# EasyEDA Pro project PollutagNode2_rev4_2026-10-08.epro

# Schematic pollutagNode2
Board Name: PCB; Create Date: 2025-01-23; Page Name: Schematic; Project Name: PollutagNode2; Schematic Name: pollutagNode2; Update Date: 2026-04-22; Add into BOM: yes; Company: pollutants.eu; Convert to PCB: yes; Date: 2024-11-21; Draw By: Aleksei Tertychnyi; REV: 4.0; Sheet: 1/1
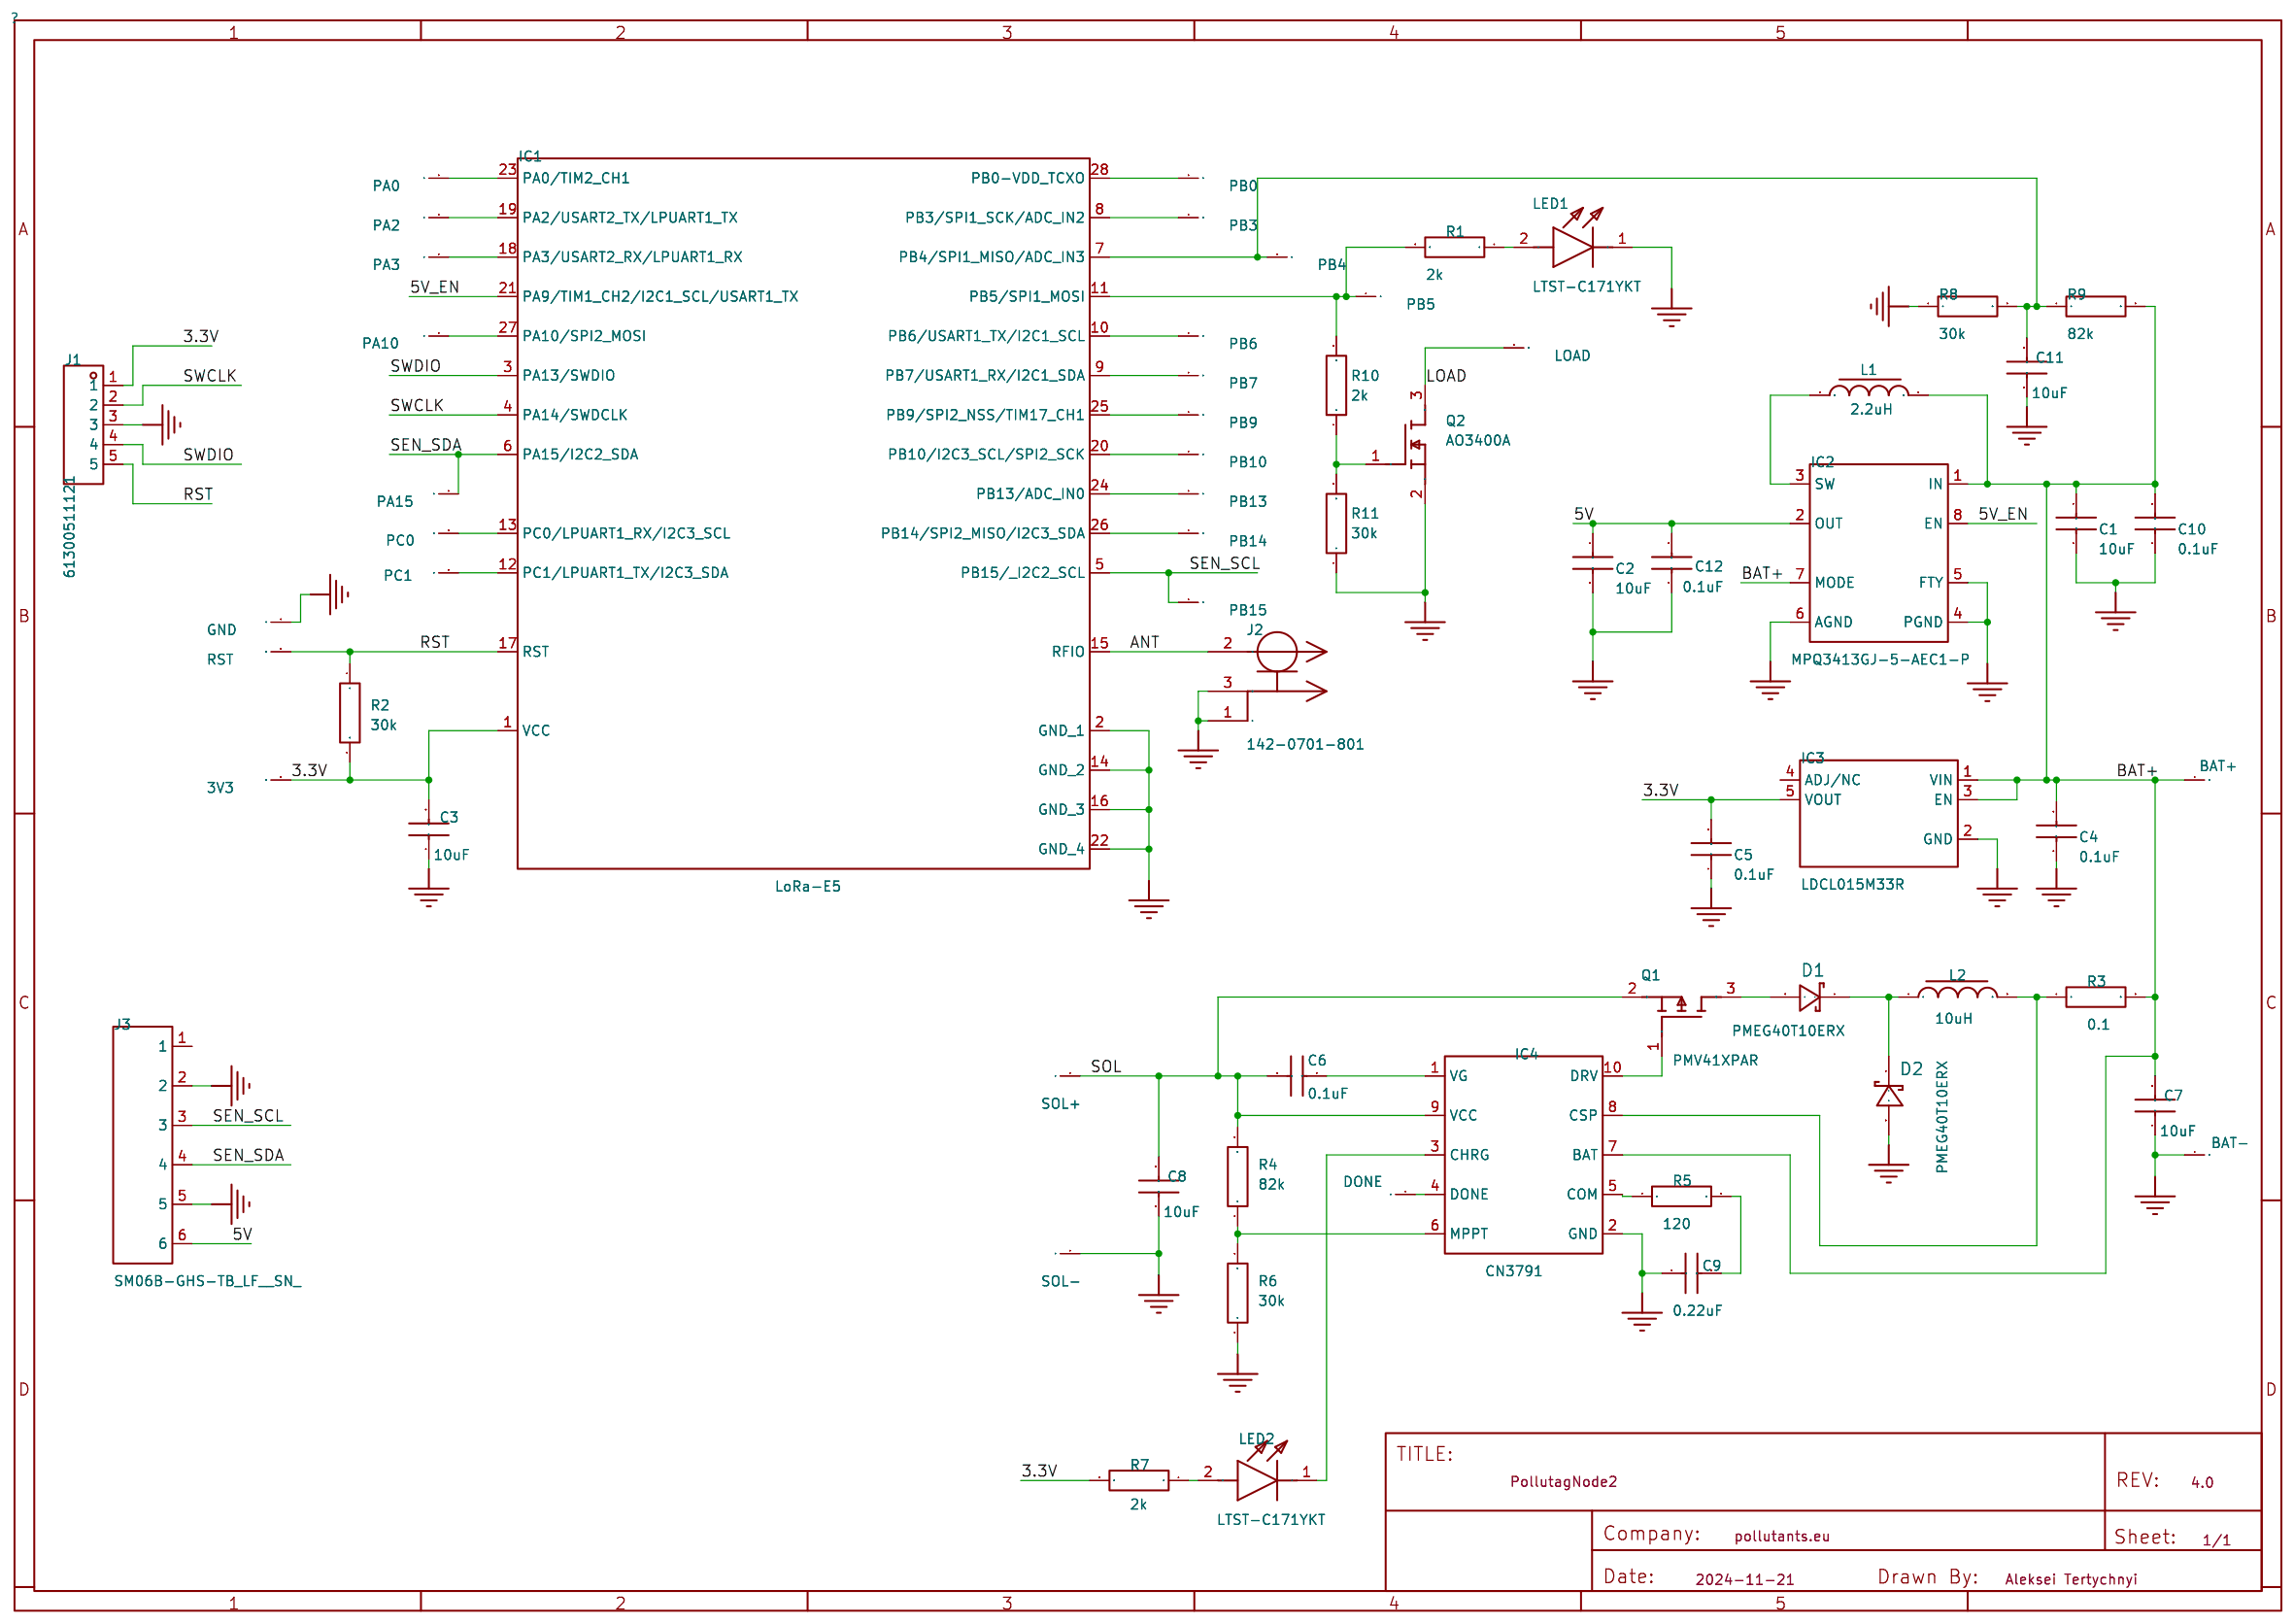
[diagram p0: schematic sheet]

## Parts
3V3  S1751-46R  [S1751-46R]  (no BOM)
BAT+  S1751-46R  [S1751-46R]  (no BOM)
BAT-  S1751-46R  [S1751-46R]  (no BOM)
C1  10uF  [CAP0603]
C2  10uF  [CAP0603]
C3  10uF  [CAP0603]
C4  0.1uF  [CAP0603]
C5  0.1uF  [CAP0603]
C6  0.1uF  [CAP0603]
C7  10uF  [CAP0603]
C8  10uF  [CAP0603]
C9  0.22uF  [CAP0603]
C10  0.1uF  [CAP0603]
C11  10uF  [CAP0603]
C12  0.1uF  [CAP0603]
D1  PMEG40T10ERX  [SOD-123_L2.6-W1.7-LS3.5-RD]
D2  PMEG40T10ERX  [SOD-123_L2.6-W1.7-LS3.5-RD]
DONE  S1751-46R  [S1751-46R]  (no BOM)
GND  S1751-46R  [S1751-46R]  (no BOM)
IC1  LoRa-E5  [LORAE5]
IC2  MPQ3413GJ-5-AEC1-P  [SOT65P280X100-8N]
IC3  LDCL015M33R  [SOT95P280X145-5N]
IC4  CN3791  [SOP100P600X175-10N]
J1  61300511121  [HDR-TH_5P-P2.54-V-M]  (no BOM)
J2  142-0701-801  [142-0701-801]
J3  SM06B-GHS-TB_LF__SN_  [SM06B-GHS-TB]
L1  2.2uH  [IND-SMD_L3.0-W3.0_SRN3015]
L2  10uH  [IND-SMD_L3.0-W3.0_SRN3015]
LED1  LTST-C171YKT  [LEDC2012X90N]
LED2  LTST-C171YKT  [LEDC2012X90N]
LOAD  S1751-46R  [S1751-46R]  (no BOM)
PA0  S1751-46R  [S1751-46R]  (no BOM)
PA2  S1751-46R  [S1751-46R]  (no BOM)
PA3  S1751-46R  [S1751-46R]  (no BOM)
PA10  S1751-46R  [S1751-46R]  (no BOM)
PA15  S1751-46R  [S1751-46R]  (no BOM)
PB0  S1751-46R  [S1751-46R]  (no BOM)
PB3  S1751-46R  [S1751-46R]  (no BOM)
PB4  S1751-46R  [S1751-46R]  (no BOM)
PB5  S1751-46R  [S1751-46R]  (no BOM)
PB6  S1751-46R  [S1751-46R]  (no BOM)
PB7  S1751-46R  [S1751-46R]  (no BOM)
PB9  S1751-46R  [S1751-46R]  (no BOM)
PB10  S1751-46R  [S1751-46R]  (no BOM)
PB13  S1751-46R  [S1751-46R]  (no BOM)
PB14  S1751-46R  [S1751-46R]  (no BOM)
PB15  S1751-46R  [S1751-46R]  (no BOM)
PC0  S1751-46R  [S1751-46R]  (no BOM)
PC1  S1751-46R  [S1751-46R]  (no BOM)
Q1  PMV41XPAR  [SOT-23-3_L2.9-W1.6-P1.90-LS2.8-BR]
Q2  AO3400A  [SOT-23-3_L2.9-W1.6-P1.90-LS2.8-BR]
R1  2k  [R0603]
R2  30k  [R0603]
R3  0.1  [RESC3216X70N]
R4  82k  [R0603]
R5  120  [R0603]
R6  30k  [R0603]
R7  2k  [R0603]
R8  30k  [R0603]
R9  82k  [R0603]
R10  2k  [R0603]
R11  30k  [R0603]
RST  S1751-46R  [S1751-46R]  (no BOM)
SOL+  S1751-46R  [S1751-46R]  (no BOM)
SOL-  S1751-46R  [S1751-46R]  (no BOM)

## Library data of the parts
3V3 BAT+ BAT- DONE GND LOAD PA0 PA2 PA3 PA10 PA15 PB0 PB3-PB7 PB9 PB10 PB13-PB15 PC0 PC1 RST SOL+ SOL- = S1751-46R: Supplier: Mouser; Supplier Part: 855-S1751-46R; Manufacturer: Harwin
C1-C3 C7 C8 C11 = 10uF: Supplier Part: 81-GRM188R61C106KALD; Manufacturer: Murata Electronics; Manufacturer Part: GRM188R61C106KALD; Supplier: Mouser
C4-C6 C10 C12 = 0.1uF: Supplier: Mouser; Supplier Part: 581-06035C104KAT2A; Manufacturer: AVX; Manufacturer Part: 06035C104KAT2A
C9 = 0.22uF: Supplier Part: 603-AC0603X7R9BB224; Manufacturer: KEMET; Supplier: Mouser; Manufacturer Part: AC0603X7R9BB224
D1 D2 = PMEG40T10ERX: Diode Configuration:1 Independent Voltage - Forward(Vf@If):460mV@1A Voltage - DC Reverse(Vr):40V Current - Rectified:1A Reverse Leakage Current (Ir):22uA@40V Non-Repetitive Peak Forward Surge Current:20A; LCSC Part Name: 电压:40V 电流:1A; Supplier Part: C552916; Manufacturer: Nexperia(安世); Supplier Footprint: SOD-123W; JLCPCB Part Class: Extended Part; Datasheet: https://item.szlcsc.com/datasheet/PMEG40T10ERX/573913.html; Supplier: LCSC; Diode Configuration: 1 Independent; Voltage - Forward(Vf@If): 460mV@1A; Voltage - DC Reverse(Vr): 40V; Current - Rectified: 1A; Reverse Leakage Current (Ir): 22uA@40V; Non-Repetitive Peak Forward Surge Current: 20A
IC1 = LoRa-E5: Supplier Part: 713-317990687; Manufacturer: SEEED STUDIO; Manufacturer Part: 317990687; Supplier: Mouser
IC2 = MPQ3413GJ-5-AEC1-P: Supplier Part: 946-MPQ3413GJ5AEC1P; Supplier: Mouser; Manufacturer: Monolithic Power Systems (MPS)
IC3 = LDCL015M33R: Supplier Part: 511-LDCL015M33R; Manufacturer: STMicroelectronics; Supplier: Mouser
IC4 = CN3791: Supplier Part: C154992; Manufacturer: Consonance; Supplier: LCSC
J1 = 61300511121: Pitch:2.54mm Mounting Type:Direct Insert Number of Rows:Single Row Number of Pins:5P Current Rating (Max):3A Voltage Rating (Max):250V Contact Material:Copper Alloy Operating Temperature Range:-40℃~+105℃ Operating Temperature Range:-40℃~+105℃ Color:Black; Manufacturer: Wurth(伍尔特); Supplier: LCSC; Supplier Part: C6461551; LCSC Part Name: 间距:2.54mm 直插; Supplier Footprint: 插件,P=2.54mm; JLCPCB Part Class: Extended Part; Pitch: 2.54mm; Mounting Type: Direct Insert; Number of Rows: Single Row; Number of Pins: 5P; Current Rating (Max): 3A; Voltage Rating (Max): 250V; Contact Material: Copper Alloy; Operating Temperature Range: -40℃~+105℃; Color: Black
J2 = 142-0701-801: Supplier Part: 530-142-0701-801; Manufacturer: Cinch Connectivity Solutions; Supplier: Mouser
J3 = SM06B-GHS-TB_LF__SN_: Supplier Part: 306-SM06BGHSTBLFSN; Manufacturer: JST (JAPAN SOLDERLESS TERMINALS); Manufacturer Part: SM06B-GHS-TB(LF)(SN); Supplier: Mouser
L1 = 2.2uH: Manufacturer: Bourns; Supplier Part: 652-SRN3015-2R2M; Supplier: Mouser; Manufacturer Part: SRN3015-2R2M
L2 = 10uH: Supplier Part: 652-SRN3015BTA-100M; Manufacturer: Bourns; Supplier: Mouser; Manufacturer Part: SRN3015BTA-100M
LED1 LED2 = LTST-C171YKT: Supplier Part: 859-LTST-C171YKT; Manufacturer: Lite-On; Supplier: Mouser
Q1 = PMV41XPAR: Manufacturer: Nexperia; Supplier Part: 771-PMV41XPAR; Supplier: Mouser
Q2 = AO3400A: Supplier Part: 785-1000-1-ND; Manufacturer: Alpha & Omega Semiconductors; Supplier: Digi-Key
R1 R7 R10 = 2k: Supplier Part: 603-RC0603FR-072KL; Manufacturer: Yageo; Supplier: Mouser; Manufacturer Part: RC0603FR-072KL
R2 R6 R8 R11 = 30k: Supplier Part: 652-CR0603FX-3002ELF; Manufacturer: Bourns; Supplier: Mouser; Manufacturer Part: CR0603-FX-3002ELF
R3 = 0.1: Supplier Part: 652-CRL1206FWR100ELF; Manufacturer: Bourns; Supplier: Mouser; Manufacturer Part: CRL1206FWR100ELF
R4 R9 = 82k: Supplier Part: 603-RT0603FRE0782KL; Manufacturer: KEMET; Supplier: Mouser; Manufacturer Part: RT0603FRE0782KL
R5 = 120: Supplier Part: 667-ERJ-U03J121V; Manufacturer: Panasonic; Supplier: Mouser; Manufacturer Part: ERJ-U03J121V

## Nets
3.3V: 3V3.1 C3.2 C5.2 IC1.1(VCC) IC3.5(VOUT) J1.1 R2.2 R7.2
5V: C2.1 C12.2 IC2.2(OUT) J3.6
5V_EN: IC1.21(PA9/TIM1_CH2/I2C1_SCL/USART1_TX) IC2.8(EN)
GND: BAT-.1 C1.2 C2.2 C3.1 C4.1 C5.1 C7.1 C8.1 C9.1 C10.1 C11.1 C12.1 D2.2(+) GND.1 IC1.2(GND_1) IC1.14(GND_2) IC1.16(GND_3) IC1.22(GND_4) IC2.4(PGND) IC2.5(FTY) IC2.6(AGND) IC3.2(GND) IC4.2(GND) J1.3 J2.1 J2.3 J3.2 J3.5 LED1.1(K) Q2.2(S) R6.1 R8.1 R11.1 SOL-.1
ANT: IC1.15(RFIO) J2.2
BAT+: BAT+.1 C1.1 C4.2 C7.2 C10.2 IC2.1(IN) IC2.7(MODE) IC3.1(VIN) IC3.3(EN) IC4.7(BAT) L1.1 R3.2 R9.2
LOAD: LOAD.1 Q2.3(D)
RST: IC1.17(RST) J1.5 R2.1 RST.1
SEN_SCL: IC1.5(PB15/ I2C2_SCL) J3.3 PB15.1
SEN_SDA: IC1.6(PA15/I2C2_SDA) J3.4 PA15.1
SOL: C6.1 C8.2 IC4.9(VCC) Q1.2(S) R4.2 SOL+.1
SWCLK: IC1.4(PA14/SWDCLK) J1.2
SWDIO: IC1.3(PA13/SWDIO) J1.4
$1N6: IC1.11(PB5/SPI1_MOSI) PB5.1 R1.2 R10.2
$1N7: Q2.1(G) R10.1 R11.2
$1N11: IC4.3(CHRG) LED2.1(K)
$1N12: C11.2 IC1.7(PB4/SPI1_MISO/ADC_IN3) PB4.1 R8.2 R9.1
$1N25: IC1.12(PC1/LPUART1_TX/I2C3_SDA) PC1.1
$1N26: IC1.13(PC0/LPUART1_RX/I2C3_SCL) PC0.1
$1N28: IC1.27(PA10/SPI2_MOSI) PA10.1
$1N29: IC1.18(PA3/USART2_RX/LPUART1_RX) PA3.1
$1N30: IC1.19(PA2/USART2_TX/LPUART1_TX) PA2.1
$1N31: IC1.23(PA0/TIM2_CH1) PA0.1
$1N32: IC1.26(PB14/SPI2_MISO/I2C3_SDA) PB14.1
$1N33: IC1.24(PB13/ADC_IN0) PB13.1
$1N34: IC1.20(PB10/I2C3_SCL/SPI2_SCK) PB10.1
$1N35: IC1.25(PB9/SPI2_NSS/TIM17_CH1) PB9.1
$1N36: IC1.9(PB7/USART1_RX/I2C1_SDA) PB7.1
$1N37: IC1.10(PB6/USART1_TX/I2C1_SCL) PB6.1
$1N40: IC1.8(PB3/SPI1_SCK/ADC_IN2) PB3.1
$1N50: LED1.2(A) R1.1
$1N57: IC2.3(SW) L1.2
$1N60: C9.2 R5.2
$1N61: IC4.5(COM) R5.1
$1N63: IC4.8(CSP) L2.2 R3.1
$1N64: D1.1(-) D2.1(-) L2.1
$1N72: D1.2(+) Q1.3(D)
$1N73: IC4.10(DRV) Q1.1(G)
$1N75: LED2.2(A) R7.1
$1N76: IC4.6(MPPT) R4.1 R6.2
$1N77: IC1.28(PB0-VDD_TCXO) PB0.1
$1N78: C6.2 IC4.1(VG)
$1N83: DONE.1 IC4.4(DONE)

Not connected (* = marked no-connect by the designer): IC3 4(ADJ/NC); J3 1

# Board PCB
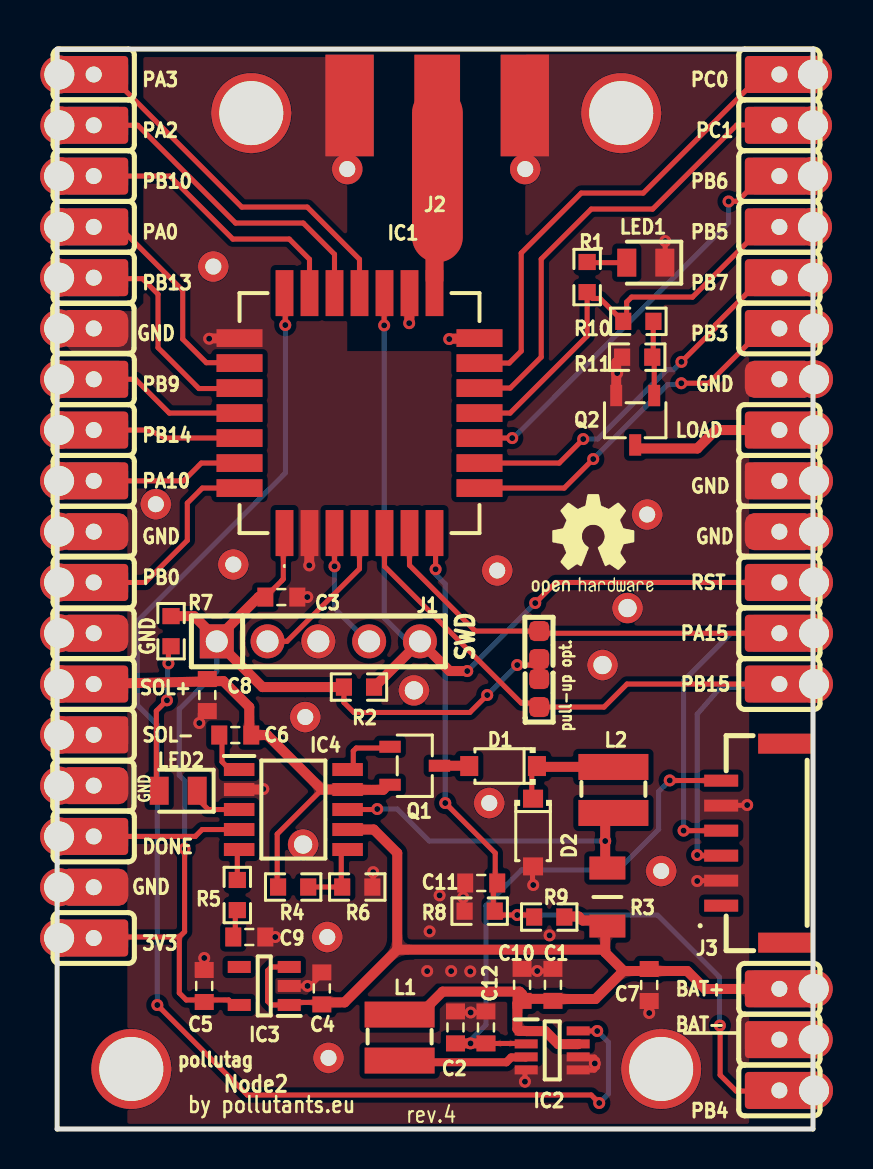
[diagram p1: board, top side]
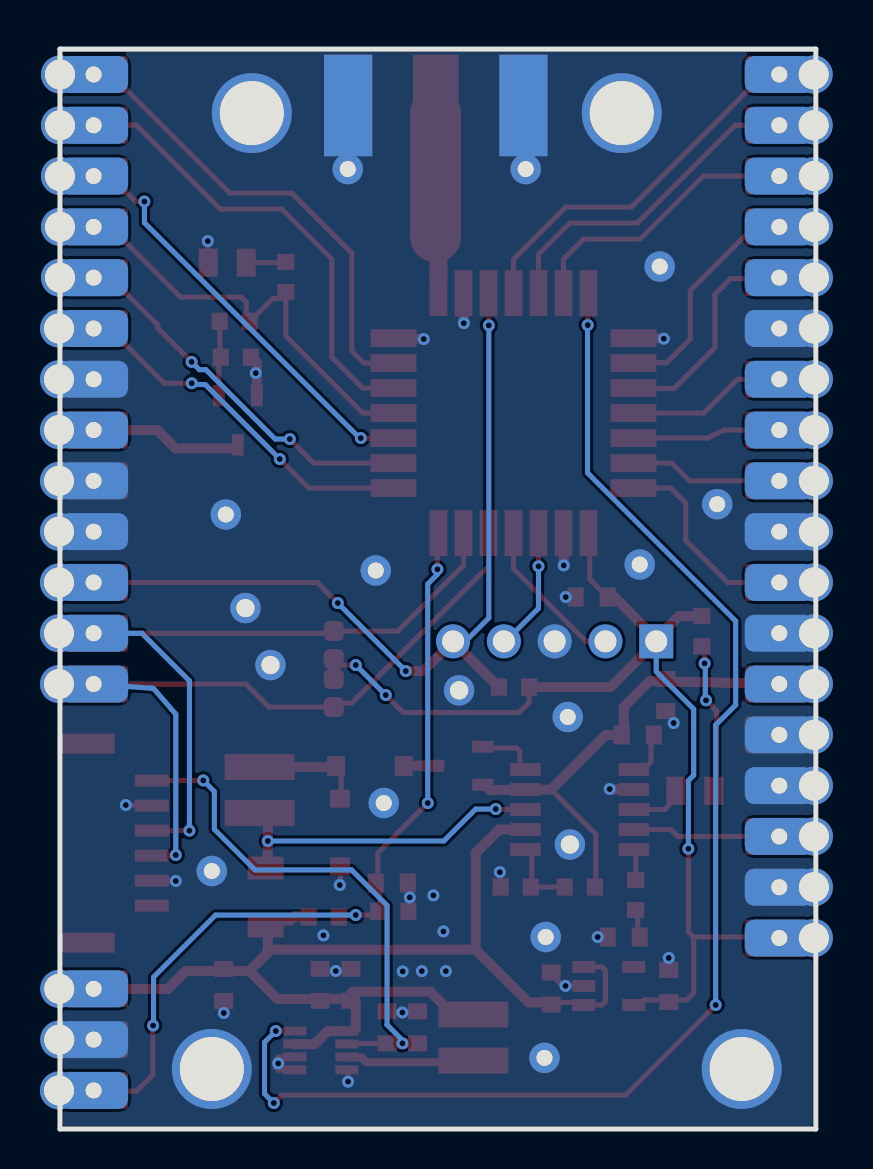
[diagram p2: board, bottom side, seen from below]

Outline 37.8 x 54 mm; copper layers: Top Layer, Bottom Layer. Coordinates in mm from the lower left corner of the outline.
Outline path: 0,54 0,0 37.8,0 37.8,54 0,54
Stack: Top Layer 0.035mm / Dielectric1 1.51mm FR4 er 4.5 / Bottom Layer 0.035mm

## Design rules (mm)
spacing Default (default): track to track 0.025, other pairs 0 to 0.025
spacing Plane_Default: track to track 0.025, other pairs 0 to 0.025
spacing Copper_Default: track to track 0.025, other pairs 0 to 0.025
spacing Copper_CopperRegion: track to track 0.025, other pairs 0 to 0.025
spacing Copper_(1): track to track 0.025, other pairs 0 to 0.025
spacing Copper_(2): track to track 0.025, other pairs 0 to 0.025
track width Default (default): min 0.025, default 0.025, max 25.4
differential pair differentialPair (default): width min 0.127, default 0.254, max 2.54; gap min 0.152, default 0.152
pour e784 uses CopperRegion, Copper_Default
pour e978 uses (2), Copper_Default
pour e895 uses CopperRegion, Copper_Default

## Placement (name value [footprint] x y rotation side)
3V3  -  [S1751-46R]  1.83 9.55 180 top
BAT+  -  [S1751-46R]  36.12 7.01 180 top
BAT-  -  [S1751-46R]  36.12 4.47 180 top
C1  10uF  [CAP0603]  24.79 7.21 90 top
C2  10uF  [CAP0603]  19.92 5.08 90 top
C3  10uF  [CAP0603]  11.21 26.6 180 top
C4  0.1uF  [CAP0603]  13.23 7.03 270 top
C5  0.1uF  [CAP0603]  7.35 7.15 270 top
C6  0.1uF  [CAP0603]  8.91 19.7 180 top
C7  10uF  [CAP0603]  29.61 7.2 90 top
C8  10uF  [CAP0603]  7.51 21.7 90 top
C9  0.22uF  [CAP0603]  9.61 9.6 180 top
C10  0.1uF  [CAP0603]  23.25 7.21 270 top
C11  10uF  [CAP0603]  21.21 12.3 0 top
C12  0.1uF  [CAP0603]  21.44 5.08 270 top
D1  PMEG40T10ERX  [SOD-123_L2.6-W1.7-LS3.5-RD]  22.3 18.15 180 top
D2  PMEG40T10ERX  [SOD-123_L2.6-W1.7-LS3.5-RD]  23.8 14.83 270 top
DONE  -  [S1751-46R]  1.83 14.63 180 top
GND  -  [S1751-46R]  36.12 32.41 180 top
IC1  LoRa-E5  [LORAE5]  15.12 35.8 90 top
IC2  MPQ3413GJ-5-AEC1-P  [SOT65P280X100-8N]  24.76 3.93 0 top
IC3  LDCL015M33R  [SOT95P280X145-5N]  10.36 7.15 180 top
IC4  CN3791  [SOP100P600X175-10N]  11.81 15.98 0 top
J1  61300511121  [HDR-TH_5P-P2.54-V-M]  13.06 24.38 0 top
J2  -  [142-0701-801]  19.01 53.72 0 top
J3  SM06B-GHS-TB_LF__SN_  [SM06B-GHS-TB]  37.51 8.92 90 top
L1  2.2uH  [IND-SMD_L3.0-W3.0_SRN3015]  17.13 4.57 270 top
L2  10uH  [IND-SMD_L3.0-W3.0_SRN3015]  27.82 16.95 270 top
LED1  LTST-C171YKT  [LEDC2012X90N]  29.44 43.32 180 top
LED2  LTST-C171YKT  [LEDC2012X90N]  6.05 16.92 180 top
LOAD  -  [S1751-46R]  36.12 34.95 180 top
NOREF  -  [Pad_e106]  37.8 45.11 0 top
NOREF#2  -  [Pad_e103]  37.8 52.73 0 top
NOREF#3  -  [Pad_e122]  0.1 45.11 0 top
NOREF#4  -  [Pad_e74]  36.12 34.95 0 top
NOREF#5  -  [Pad_e121]  0.1 47.65 0 top
NOREF#6  -  [Pad_e166]  36.12 42.57 0 top
NOREF#7  -  [Pad_e105]  37.8 47.65 0 top
NOREF#8  -  [Pad_e142]  7.81 43.13 0 top
NOREF#9  -  [Pad_e146]  1.83 12.09 0 top
NOREF#10  -  [Pad_e101]  24.11 23.5 0 top
NOREF#11  -  [Pad_e160]  36.12 50.19 0 top
NOREF#12  -  [Pad_e117]  37.84 4.47 0 top
NOREF#13  -  [Pad_e80]  36.12 50.19 0 top
NOREF#14  -  [Pad_e86]  1.83 42.57 0 top
NOREF#15  -  [Pad_e185]  36.12 27.33 0 top
NOREF#16  -  [Pad_e78]  36.12 45.11 0 top
NOREF#17  -  [Pad_e70]  36.12 24.79 0 top
NOREF#18  -  [Pad_e144]  22.01 27.93 0 top
NOREF#19  -  [Pad_e108]  37.85 37.49 0 top
NOREF#20  -  [Pad_e110]  37.85 34.95 0 top
NOREF#21  -  [Pad_e81]  36.12 52.73 0 top
NOREF#22  -  [Pad_e87]  1.83 37.49 0 top
NOREF#23  -  [Pad_e95]  1.83 29.87 0 top
NOREF#24  -  [Pad_e133]  0.1 17.17 0 top
NOREF#25  -  [Pad_e171]  3.71 3 0 top
NOREF#26  -  [Pad_e180]  36.12 32.41 0 top
NOREF#27  -  [Pad_e68]  36.12 7.01 0 top
NOREF#28  -  [Pad_e155]  1.83 42.57 0 top
NOREF#29  -  [Pad_e177]  36.12 7.01 0 top
NOREF#30  -  [Pad_e188]  17.84 21.93 0 top
NOREF#31  -  [Pad_e189]  28.53 26.05 0 top
NOREF#32  -  [Pad_e178]  36.12 45.11 0 top
NOREF#33  -  [Pad_e127]  0.1 32.41 0 top
NOREF#34  -  [Pad_e128]  0.1 29.87 0 top
NOREF#35  -  [Pad_e140]  30.21 12.9 0 top
NOREF#36  -  [Pad_e100]  24.11 22.5 0 top
NOREF#37  -  [Pad_e153]  1.83 37.49 0 top
NOREF#38  -  [Pad_e141]  13.57 3.56 0 top
NOREF#39  -  [Pad_e159]  36.12 52.73 0 top
NOREF#40  -  [Pad_e92]  1.83 12.09 0 top
NOREF#41  -  [Pad_e136]  0.1 9.55 0 top
NOREF#42  -  [Pad_e154]  1.83 40.03 0 top
NOREF#43  -  [Pad_e102]  24.11 24.9 0 top
NOREF#44  -  [Pad_e137]  12.41 20.6 0 top
NOREF#45  -  [Pad_e173]  14.51 48 0 top
NOREF#46  -  [Pad_e174]  23.41 48 0 top
NOREF#47  -  [Pad_e69]  36.12 22.25 0 top
NOREF#48  -  [Pad_e111]  37.85 32.41 0 top
NOREF#49  -  [Pad_e93]  1.83 17.17 0 top
NOREF#50  -  [Pad_e85]  1.83 45.11 0 top
NOREF#51  -  [Pad_e64]  1.83 27.33 0 top
NOREF#52  -  [Pad_e132]  0.1 19.71 0 top
NOREF#53  -  [Pad_e107]  37.8 42.57 0 top
NOREF#54  -  [Pad_e172]  28.21 50.8 0 top
NOREF#55  -  [Pad_e165]  36.12 40.03 0 top
NOREF#56  -  [Pad_e82]  1.83 52.73 0 top
NOREF#57  -  [Pad_e67]  36.12 4.47 0 top
NOREF#58  -  [Pad_e163]  36.12 29.87 0 top
NOREF#59  -  [Pad_e120]  0.11 50.19 0 top
NOREF#60  -  [Pad_e152]  1.83 34.95 0 top
NOREF#61  -  [Pad_e162]  1.83 52.73 0 top
NOREF#62  -  [Pad_e139]  13.51 9.6 0 top
NOREF#63  -  [Pad_e150]  1.83 27.33 0 top
NOREF#64  -  [Pad_e125]  0.1 37.49 0 top
NOREF#65  -  [Pad_e138]  21.61 16.3 0 top
NOREF#66  -  [Pad_e148]  1.83 24.79 0 top
NOREF#67  -  [Pad_e90]  1.83 29.87 0 top
NOREF#68  -  [Pad_e130]  0.1 24.79 0 top
NOREF#69  -  [Pad_e156]  1.83 45.11 0 top
NOREF#70  -  [Pad_e151]  1.83 32.41 0 top
NOREF#71  -  [Pad_e66]  36.12 1.93 0 top
NOREF#72  -  [Pad_e182]  36.12 4.47 0 top
NOREF#73  -  [Pad_e119]  0.11 52.73 0 top
NOREF#74  -  [Pad_e91]  1.83 40.03 0 top
NOREF#75  -  [Pad_e175]  1.83 22.25 0 top
NOREF#76  -  [Pad_e176]  1.83 19.71 0 top
NOREF#77  -  [Pad_e129]  0.1 27.33 0 top
NOREF#78  -  [Pad_e169]  9.71 50.8 0 top
NOREF#79  -  [Pad_e124]  0.1 40.03 0 top
NOREF#80  -  [Pad_e135]  0.1 12.09 0 top
NOREF#81  -  [Pad_e114]  37.85 24.79 0 top
NOREF#82  -  [Pad_e161]  36.12 47.65 0 top
NOREF#83  -  [Pad_e167]  1.83 9.55 0 top
NOREF#84  -  [Pad_e186]  4.93 31.24 0 top
NOREF#85  -  [Pad_e76]  36.12 40.03 0 top
NOREF#86  -  [Pad_e113]  37.85 27.33 0 top
NOREF#87  -  [Pad_e116]  37.84 7.01 0 top
NOREF#88  -  [Pad_e126]  0.09 34.95 0 top
NOREF#89  -  [Pad_e118]  37.85 1.93 0 top
NOREF#90  -  [Pad_e58]  1.83 9.55 0 top
NOREF#91  -  [Pad_e143]  8.81 28.23 0 top
NOREF#92  -  [Pad_e75]  36.12 37.49 0 top
NOREF#93  -  [Pad_e99]  24.11 21.1 0 top
NOREF#94  -  [Pad_e84]  1.83 47.65 0 top
NOREF#95  -  [Pad_e134]  0.1 14.63 0 top
NOREF#96  -  [Pad_e164]  36.12 37.49 0 top
NOREF#97  -  [Pad_e83]  1.83 50.19 0 top
NOREF#98  -  [Pad_e59]  1.83 12.09 0 top
NOREF#99  -  [Pad_e145]  29.51 30.73 0 top
NOREF#100  -  [Pad_e187]  12.3 14.22 0 top
NOREF#101  -  [Pad_e123]  0.1 42.57 0 top
NOREF#102  -  [Pad_e62]  1.83 19.71 0 top
NOREF#103  -  [Pad_e88]  1.83 34.95 0 top
NOREF#104  -  [Pad_e109]  37.85 40.03 0 top
NOREF#105  -  [Pad_e98]  36.12 37.49 0 top
NOREF#106  -  [Pad_e71]  36.12 27.33 0 top
NOREF#107  -  [Pad_e112]  37.85 29.87 0 top
NOREF#108  -  [Pad_e61]  1.83 17.17 0 top
NOREF#109  -  [Pad_e79]  36.12 47.65 0 top
NOREF#110  -  [Pad_e73]  36.12 32.41 0 top
NOREF#111  -  [Pad_e77]  36.12 42.57 0 top
NOREF#112  -  [Pad_e147]  1.83 17.17 0 top
NOREF#113  -  [Pad_e131]  0.1 22.25 0 top
NOREF#114  -  [Pad_e104]  37.8 50.19 0 top
NOREF#115  -  [Pad_e183]  36.12 22.25 0 top
NOREF#116  -  [Pad_e97]  36.12 29.87 0 top
NOREF#117  -  [Pad_e181]  36.12 1.93 0 top
NOREF#118  -  [Pad_e60]  1.83 14.63 0 top
NOREF#119  -  [Pad_e89]  1.83 32.41 0 top
NOREF#120  -  [Pad_e190]  27.28 23.2 0 top
NOREF#121  -  [Pad_e96]  1.83 40.03 0 top
NOREF#122  -  [Pad_e72]  36.12 29.87 0 top
NOREF#123  -  [Pad_e63]  1.83 22.25 0 top
NOREF#124  -  [Pad_e168]  1.83 14.63 0 top
NOREF#125  -  [Pad_e158]  1.83 50.19 0 top
NOREF#126  -  [Pad_e179]  36.12 34.95 0 top
NOREF#127  -  [Pad_e94]  1.83 24.79 0 top
NOREF#128  -  [Pad_e170]  30.21 3 0 top
NOREF#129  -  [Pad_e157]  1.83 47.65 0 top
NOREF#130  -  [Pad_e65]  1.83 24.79 0 top
NOREF#131  -  [Pad_e149]  1.83 29.87 0 top
NOREF#132  -  [Pad_e115]  37.85 22.25 0 top
NOREF#133  -  [Pad_e184]  36.12 24.79 0 top
PA0  -  [S1751-46R]  1.83 45.11 0 top
PA2  -  [S1751-46R]  1.83 50.19 180 top
PA3  -  [S1751-46R]  1.83 52.73 180 top
PA10  -  [S1751-46R]  1.83 32.41 180 top
PA15  -  [S1751-46R]  36.12 24.79 180 top
PB0  -  [S1751-46R]  1.83 27.33 180 top
PB3  -  [S1751-46R]  36.12 40.03 180 top
PB4  -  [S1751-46R]  36.12 1.93 180 top
PB5  -  [S1751-46R]  36.12 45.11 180 top
PB6  -  [S1751-46R]  36.12 47.65 0 top
PB7  -  [S1751-46R]  36.12 42.57 180 top
PB9  -  [S1751-46R]  1.83 37.49 0 top
PB10  -  [S1751-46R]  1.83 47.65 0 top
PB13  -  [S1751-46R]  1.83 42.57 0 top
PB14  -  [S1751-46R]  1.83 34.95 180 top
PB15  -  [S1751-46R]  36.12 22.25 180 top
PC0  -  [S1751-46R]  36.12 52.73 0 top
PC1  -  [S1751-46R]  36.12 50.19 180 top
Q1  PMV41XPAR  [SOT-23-3_L2.9-W1.6-P1.90-LS2.8-BR]  17.88 18.16 180 top
Q2  AO3400A  [SOT-23-3_L2.9-W1.6-P1.90-LS2.8-BR]  28.91 35.44 90 top
R1  2k  [R0603]  26.5 42.6 270 top
R2  30k  [R0603]  15.09 22.1 180 top
R3  0.1  [RESC3216X70N]  27.52 11.6 270 top
R4  82k  [R0603]  11.8 12.1 180 top
R5  120  [R0603]  9.01 11.7 270 top
R6  30k  [R0603]  15.01 12.1 180 top
R7  2k  [R0603]  5.7 24.89 90 top
R8  30k  [R0603]  21.13 10.89 0 top
R9  82k  [R0603]  24.61 10.6 0 top
R10  2k  [R0603]  29.06 40.39 180 top
R11  30k  [R0603]  29.01 38.59 0 top
RST  -  [S1751-46R]  36.12 27.33 180 top
SOL+  -  [S1751-46R]  1.83 22.25 180 top
SOL-  -  [S1751-46R]  1.83 19.71 180 top

## Footprints (pads in the part's own frame, mm; a bottom-side part is the same pattern mirrored in y, then rotated)
142-0701-801
  rect 2.413x5.08 smd: 1(-4.381,-2.54) 3(4.381,-2.54)
  rect 2.413x5.08 smd far side: 1(-4.381,-2.54) 3(4.381,-2.54)
  rect 2.286x5.08 smd: 2(0,-2.54)
CAP0603
  rect 0.8x0.95 smd: 1(-0.8,0) 2(0.8,0)
HDR-TH_5P-P2.54-V-M
  rect 1.7x1.7 hole 1.1: 1(-5.08,0)
  round 1.7 hole 1.1: 2(-2.54,0) 3(0,0) 4(2.54,0) 5(5.08,0)
IND-SMD_L3.0-W3.0_SRN3015
  rect 1.3x3.5 smd: 1(-1.15,0) 2(1.15,0)
LEDC2012X90N
  rect 0.95x1.4 smd: 1(-0.95,0) 2(0.95,0)
LORAE5
  rect 2.3x0.889 smd: 1(-6,3.75) 2(-6,2.5) 3(-6,1.25) 4(-6,0) 5(-6,-1.25) 6(-6,-2.5) 7(-6,-3.75) 15(6,-3.75) 16(6,-2.5) 17(6,-1.25) 18(6,0) 19(6,1.25) 20(6,2.5) 21(6,3.75)
  rect 0.889x2.3 smd: 8(-3.75,-6) 9(-2.5,-6) 10(-1.25,-6) 11(0,-6) 12(1.25,-6) 13(2.5,-6) 14(3.75,-6) 22(3.75,6) 23(2.5,6) 24(1.25,6) 25(0,6) 26(-1.25,6) 27(-2.5,6) 28(-3.75,6)
Pad_e58
  custom 0x0 smd far side: 12(0,0)
Pad_e59
  custom 0x0 smd far side: 12(0,0)
Pad_e60
  custom 0x0 smd far side: 12(0,0)
Pad_e61
  custom 0x0 smd far side: 12(0,0)
Pad_e62
  custom 0x0 smd far side: 12(0,0)
Pad_e63
  custom 0x0 smd far side: 12(0,0)
Pad_e64
  custom 0x0 smd far side: 12(0,0)
Pad_e65
  custom 0x0 smd far side: 10(0,0)
Pad_e66
  custom 0x0 smd far side: 9(0,0)
Pad_e67
  custom 0x0 smd far side: 9(0,0)
Pad_e68
  custom 0x0 smd far side: 9(0,0)
Pad_e69
  custom 0x0 smd far side: 9(0,0)
Pad_e70
  custom 0x0 smd far side: 9(0,0)
Pad_e71
  custom 0x0 smd far side: 9(0,0)
Pad_e72
  custom 0x0 smd far side: 9(0,0)
Pad_e73
  custom 0x0 smd far side: 9(0,0)
Pad_e74
  custom 0x0 smd far side: 9(0,0)
Pad_e75
  custom 0x0 smd far side: 9(0,0)
Pad_e76
  custom 0x0 smd far side: 9(0,0)
Pad_e77
  custom 0x0 smd far side: 9(0,0)
Pad_e78
  custom 0x0 smd far side: 9(0,0)
Pad_e79
  custom 0x0 smd far side: 9(0,0)
Pad_e80
  custom 0x0 smd far side: 9(0,0)
Pad_e81
  custom 0x0 smd far side: 9(0,0)
Pad_e82
  custom 0x0 smd far side: 9(0,0)
Pad_e83
  custom 0x0 smd far side: 9(0,0)
Pad_e84
  custom 0x0 smd far side: 9(0,0)
Pad_e85
  custom 0x0 smd far side: 9(0,0)
Pad_e86
  custom 0x0 smd far side: 9(0,0)
Pad_e87
  custom 0x0 smd far side: 9(0,0)
Pad_e88
  custom 0x0 smd far side: 9(0,0)
Pad_e89
  custom 0x0 smd far side: 9(0,0)
Pad_e90
  custom 0x0 smd far side: 9(0,0)
Pad_e91
  custom 0x0 smd far side: 8(0,0)
Pad_e92
  custom 0x0 smd: 11(0,0)
Pad_e93
  custom 0x0 smd: 11(0,0)
Pad_e94
  custom 0x0 smd: 10(0,0)
Pad_e95
  custom 0x0 smd: 9(0,0)
Pad_e96
  custom 0x0 smd: 8(0,0)
Pad_e97
  custom 0x0 smd: 7(0,0)
Pad_e98
  custom 0x0 smd: 7(0,0)
Pad_e99
  custom 1x1 smd: 3(0,0)
Pad_e100
  custom 1x1 smd: 3(0,0)
Pad_e101
  custom 1x1 smd: 3(0,0)
Pad_e102
  custom 1x1 smd: 3(0,0)
Pad_e103
  round 1.9 hole 1.5: 1(0,0)
Pad_e104
  round 1.9 hole 1.5: 1(0,0)
Pad_e105
  round 1.9 hole 1.5: 1(0,0)
Pad_e106
  round 1.9 hole 1.5: 1(0,0)
Pad_e107
  round 1.9 hole 1.5: 1(0,0)
Pad_e108
  round 1.9 hole 1.5: 1(0,0)
Pad_e109
  round 1.9 hole 1.5: 1(0,0)
Pad_e110
  round 1.9 hole 1.5: 1(0,0)
Pad_e111
  round 1.9 hole 1.5: 1(0,0)
Pad_e112
  round 1.9 hole 1.5: 1(0,0)
Pad_e113
  round 1.9 hole 1.5: 1(0,0)
Pad_e114
  round 1.9 hole 1.5: 1(0,0)
Pad_e115
  round 1.9 hole 1.5: 1(0,0)
Pad_e116
  round 1.9 hole 1.5: 1(0,0)
Pad_e117
  round 1.9 hole 1.5: 1(0,0)
Pad_e118
  round 1.9 hole 1.5: 1(0,0)
Pad_e119
  round 1.9 hole 1.5: 1(0,0)
Pad_e120
  round 1.9 hole 1.5: 1(0,0)
Pad_e121
  round 1.9 hole 1.5: 1(0,0)
Pad_e122
  round 1.9 hole 1.5: 1(0,0)
Pad_e123
  round 1.9 hole 1.5: 1(0,0)
Pad_e124
  round 1.9 hole 1.5: 1(0,0)
Pad_e125
  round 1.9 hole 1.5: 1(0,0)
Pad_e126
  round 1.9 hole 1.5: 1(0,0)
Pad_e127
  round 1.9 hole 1.5: 1(0,0)
Pad_e128
  round 1.9 hole 1.5: 1(0,0)
Pad_e129
  round 1.9 hole 1.5: 1(0,0)
Pad_e130
  round 1.9 hole 1.5: 1(0,0)
Pad_e131
  round 1.9 hole 1.5: 1(0,0)
Pad_e132
  round 1.9 hole 1.5: 1(0,0)
Pad_e133
  round 1.9 hole 1.5: 1(0,0)
Pad_e134
  round 1.9 hole 1.5: 1(0,0)
Pad_e135
  round 1.9 hole 1.5: 1(0,0)
Pad_e136
  round 1.9 hole 1.5: 1(0,0)
Pad_e137
  round 1.524 hole 0.8: 5(0,0)
Pad_e138
  round 1.524 hole 0.8: 5(0,0)
Pad_e139
  round 1.524 hole 0.8: 5(0,0)
Pad_e140
  round 1.524 hole 0.8: 5(0,0)
Pad_e141
  round 1.524 hole 0.8: 5(0,0)
Pad_e142
  round 1.524 hole 0.8: 5(0,0)
Pad_e143
  round 1.524 hole 0.8: 5(0,0)
Pad_e144
  round 1.524 hole 0.8: 5(0,0)
Pad_e145
  round 1.524 hole 0.8: 5(0,0)
Pad_e146
  round 1.524 hole 0.8: 2(0,0)
Pad_e147
  round 1.524 hole 0.8: 2(0,0)
Pad_e148
  round 1.524 hole 0.8: 2(0,0)
Pad_e149
  round 1.524 hole 0.8: 2(0,0)
Pad_e150
  round 1.524 hole 0.8: 2(0,0)
Pad_e151
  round 1.524 hole 0.8: 2(0,0)
Pad_e152
  round 1.524 hole 0.8: 2(0,0)
Pad_e153
  round 1.524 hole 0.8: 2(0,0)
Pad_e154
  round 1.524 hole 0.8: 2(0,0)
Pad_e155
  round 1.524 hole 0.8: 2(0,0)
Pad_e156
  round 1.524 hole 0.8: 2(0,0)
Pad_e157
  round 1.524 hole 0.8: 2(0,0)
Pad_e158
  round 1.524 hole 0.8: 2(0,0)
Pad_e159
  round 1.524 hole 0.8: 2(0,0)
Pad_e160
  round 1.524 hole 0.8: 2(0,0)
Pad_e161
  round 1.524 hole 0.8: 2(0,0)
Pad_e162
  round 1.524 hole 0.8: 2(0,0)
Pad_e163
  round 1.524 hole 0.8: 5(0,0)
Pad_e164
  round 1.524 hole 0.8: 6(0,0)
Pad_e165
  round 1.524 hole 0.8: 2(0,0)
Pad_e166
  round 1.524 hole 0.8: 2(0,0)
Pad_e167
  round 1.524 hole 0.8: 2(0,0)
Pad_e168
  round 1.524 hole 0.8: 2(0,0)
Pad_e169
  round 4 hole 3.2: 4(0,0)
Pad_e170
  round 4 hole 3.2: 4(0,0)
Pad_e171
  round 4 hole 3.2: 4(0,0)
Pad_e172
  round 4 hole 3.2: 4(0,0)
Pad_e173
  round 1.524 hole 0.8: 2(0,0)
Pad_e174
  round 1.524 hole 0.8: 2(0,0)
Pad_e175
  round 1.524 hole 0.8: 2(0,0)
Pad_e176
  round 1.524 hole 0.8: 2(0,0)
Pad_e177
  round 1.524 hole 0.8: 2(0,0)
Pad_e178
  round 1.524 hole 0.8: 2(0,0)
Pad_e179
  round 1.524 hole 0.8: 2(0,0)
Pad_e180
  round 1.524 hole 0.8: 2(0,0)
Pad_e181
  round 1.524 hole 0.8: 2(0,0)
Pad_e182
  round 1.524 hole 0.8: 2(0,0)
Pad_e183
  round 1.524 hole 0.8: 2(0,0)
Pad_e184
  round 1.524 hole 0.8: 2(0,0)
Pad_e185
  round 1.524 hole 0.8: 2(0,0)
Pad_e186
  round 1.524 hole 0.8: 5(0,0)
Pad_e187
  round 1.524 hole 0.914: 1(0,0)
Pad_e188
  round 1.524 hole 0.914: 2(0,0)
Pad_e189
  round 1.524 hole 0.914: 1(0,0)
Pad_e190
  round 1.524 hole 0.914: 2(0,0)
R0603
  rect 0.806x0.864 smd: 1(-0.753,0) 2(0.753,0)
RESC3216X70N
  rect 1.15x1.8 smd: 1(-1.45,0) 2(1.45,0)
S1751-46R
  rrect 3.45x1.85 smd: 1(0,0)
SM06B-GHS-TB
  rect 0.6x1.7 smd: 1(2.25,4.3) 2(3.5,4.3) 3(4.75,4.3) 4(6,4.3) 5(7.25,4.3) 6(8.5,4.3)
  rect 1x2.7 smd: 7(0.4,1.1) 8(10.35,1.1)
SOD-123_L2.6-W1.7-LS3.5-RD
  rect 0.9x1 smd: 1(-1.692,0) 2(1.692,0)
SOP100P600X175-10N
  rect 1.525x0.65 smd: 1(-2.712,2) 2(-2.712,1) 3(-2.712,0) 4(-2.712,-1) 5(-2.712,-2) 6(2.712,-2) 7(2.712,-1) 8(2.712,0) 9(2.712,1) 10(2.712,2)
SOT65P280X100-8N
  rect 1.15x0.45 smd: 1(-1.3,0.975) 2(-1.3,0.325) 3(-1.3,-0.325) 4(-1.3,-0.975) 5(1.3,-0.975) 6(1.3,-0.325) 7(1.3,0.325) 8(1.3,0.975)
SOT95P280X145-5N
  rect 1.15x0.6 smd: 1(-1.25,0.95) 2(-1.25,0) 3(-1.25,-0.95) 4(1.25,-0.95) 5(1.25,0.95)
SOT-23-3_L2.9-W1.6-P1.90-LS2.8-BR
  rect 1.07x0.6 smd: 1(1.235,-0.95) 2(1.235,0.95) 3(-1.235,0)

## Nets
3.3V: 3V3.1 C3.2 C5.2 IC1.1 IC3.5 J1.1 NOREF#10.3 NOREF#36.3 NOREF#41.1 NOREF#83.2 NOREF#90.12 R2.2 R7.2
5V: C2.1 C12.2 IC2.2 J3.6
5V_EN: IC1.21 IC2.8
GND: BAT-.1 C1.2 C2.2 C3.1 C4.1 C5.1 C7.1 C8.1 C9.1 C10.1 C11.1 C12.1 D2.2 GND.1 IC1.2 IC1.14 IC1.16 IC1.22 IC2.4 IC2.5 IC2.6 IC3.2 IC4.2 J1.3 J2.1 J2.3 J3.2 J3.5 LED1.1 NOREF#8.5 NOREF#9.2 NOREF#12.1 NOREF#18.5 NOREF#19.1 NOREF#23.9 NOREF#24.1 NOREF#25.4 NOREF#26.2 NOREF#30.2 NOREF#31.1 NOREF#34.1 NOREF#35.5 NOREF#38.5 NOREF#40.11 NOREF#42.2 NOREF#44.5 NOREF#45.2 NOREF#46.2 NOREF#48.1 NOREF#49.11 NOREF#52.1 NOREF#54.4 NOREF#57.9 NOREF#58.5 NOREF#62.5 NOREF#65.5 NOREF#66.2 NOREF#67.9 NOREF#68.1 NOREF#72.2 NOREF#74.8 NOREF#76.2 NOREF#78.4 NOREF#79.1 NOREF#80.1 NOREF#84.5 NOREF#91.5 NOREF#92.9 NOREF#96.6 NOREF#98.12 NOREF#99.5 NOREF#100.1 NOREF#102.12 NOREF#105.7 NOREF#107.1 NOREF#108.12 NOREF#110.9 NOREF#112.2 NOREF#116.7 NOREF#120.2 NOREF#121.8 NOREF#122.9 NOREF#127.10 NOREF#128.4 NOREF#130.10 NOREF#131.2 Q2.2 R6.1 R8.1 R11.1 SOL-.1
ANT: IC1.15 J2.2
BAT+: BAT+.1 C1.1 C4.2 C7.2 C10.2 IC2.1 IC2.7 IC3.1 IC3.3 IC4.7 L1.1 NOREF#27.9 NOREF#29.2 NOREF#87.1 R3.2 R9.2
LOAD: LOAD.1 NOREF#4.9 NOREF#20.1 NOREF#126.2 Q2.3
RST: IC1.17 J1.5 NOREF#15.2 NOREF#86.1 NOREF#106.9 R2.1 RST.1
SEN_SCL: IC1.5 J3.3 NOREF#47.9 NOREF#93.3 NOREF#115.2 NOREF#132.1 PB15.1
SEN_SDA: IC1.6 J3.4 NOREF#17.9 NOREF#43.3 NOREF#81.1 NOREF#133.2 PA15.1
SOL: C6.1 C8.2 IC4.9 NOREF#75.2 NOREF#113.1 NOREF#123.12 Q1.2 R4.2 SOL+.1
SWCLK: IC1.4 J1.2
SWDIO: IC1.3 J1.4
$1N6: IC1.11 NOREF.1 NOREF#16.9 NOREF#32.2 PB5.1 R1.2 R10.2
$1N7: Q2.1 R10.1 R11.2
$1N11: IC4.3 LED2.1
$1N12: C11.2 IC1.7 NOREF#71.9 NOREF#89.1 NOREF#117.2 PB4.1 R8.2 R9.1
$1N25: IC1.12 NOREF#11.2 NOREF#13.9 NOREF#114.1 PC1.1
$1N26: IC1.13 NOREF#2.1 NOREF#21.9 NOREF#39.2 PC0.1
$1N28: IC1.27 NOREF#33.1 NOREF#70.2 NOREF#119.9 PA10.1
$1N29: IC1.18 NOREF#56.9 NOREF#61.2 NOREF#73.1 PA3.1
$1N30: IC1.19 NOREF#59.1 NOREF#97.9 NOREF#125.2 PA2.1
$1N31: IC1.23 NOREF#3.1 NOREF#50.9 NOREF#69.2 PA0.1
$1N32: IC1.26 NOREF#60.2 NOREF#88.1 NOREF#103.9 PB14.1
$1N33: IC1.24 NOREF#14.9 NOREF#28.2 NOREF#101.1 PB13.1
$1N34: IC1.20 NOREF#5.1 NOREF#94.9 NOREF#129.2 PB10.1
$1N35: IC1.25 NOREF#22.9 NOREF#37.2 NOREF#64.1 PB9.1
$1N36: IC1.9 NOREF#6.2 NOREF#53.1 NOREF#111.9 PB7.1
$1N37: IC1.10 NOREF#7.1 NOREF#82.2 NOREF#109.9 PB6.1
$1N40: IC1.8 NOREF#55.2 NOREF#85.9 NOREF#104.1 PB3.1
$1N50: LED1.2 R1.1
$1N57: IC2.3 L1.2
$1N60: C9.2 R5.2
$1N61: IC4.5 R5.1
$1N63: IC4.8 L2.2 R3.1
$1N64: D1.1 D2.1 L2.1
$1N72: D1.2 Q1.3
$1N73: IC4.10 Q1.1
$1N75: LED2.2 R7.1
$1N76: IC4.6 R4.1 R6.2
$1N77: IC1.28 NOREF#51.12 NOREF#63.2 NOREF#77.1 PB0.1
$1N78: C6.2 IC4.1
$1N83: DONE.1 IC4.4 NOREF#95.1 NOREF#118.12 NOREF#124.2

Pads without a net: IC3 4; J3 1 7 8

## Via types
v1: diameter 0.6, hole 0.3, Top Layer to Bottom Layer, 57 vias

## Routing (per net, layer and track width the routed paths; a pad name or vN(x,y) marks a point on that pad's centre or on a via; arc(x,y) is an arc through that point)
3.3V: length 55.6
  Top Layer w0.254: 10.51,26.69 11.24,27.42 11.24,27.43 11.31,27.5 11.31,29.65 ; 6.11,9.6 6.11,6.8 6.46,6.45 8.58,6.45 8.83,6.2 IC3.5 ; 6.11,9.6 1.88,9.6 NOREF#83.2 ; 6.11,9.6 6.37,9.87 v1(6.37,14.01) ; NOREF#36.3 NOREF#10.3 23.81,23.2 v1(23.01,23.2) ; v1(21.51,21.7) 20.64,20.83 14.84,20.83 14.34,21.33 R2.2
  Top Layer w0.5: C3.2 10.07,26.6 7.98,24.51 6.85,25.65 R7.2 ; R2.2 10.27,22.1 J1.1
  Bottom Layer w0.254: v1(6.37,14.01) 6.37,17.42 6.11,17.69 6.11,21 7.98,22.87 J1.1 ; v1(21.51,21.7) v1(23.01,23.2)
5V: length 26
  Top Layer w0.254: IC2.2 23.43,4.28 21.73,4.28 21.71,4.3 ; v1(30.63,17.43) 30.64,17.42 33.2,17.42 J3.6
  Top Layer w0.5: C2.1 C12.2
  Bottom Layer w0.254: v1(30.63,17.43) 30.08,16.88 30.08,14.99 28.05,12.95 23.22,12.95 21.44,11.18 21.44,5.21 20.67,4.44 v1(20.67,4.28)
5V_EN: length 68.2
  Top Layer w0.254: v1(27.11,1.3) 26.71,1.7 9.51,1.7 v1(5.01,6.2) ; IC2.8 27,4.9 v1(27.01,4.9) ; v1(11.41,40.2) 11.41,41.76 IC1.21
  Bottom Layer w0.254: v1(5.01,6.2) 5.01,20.2 4.01,21.2 4.01,25.4 11.42,32.81 11.42,40.19 ; v1(27.11,1.3) 27.57,1.76 27.57,4.34 v1(27.01,4.9)
GND: length 33.4
  Top Layer w0.254: 26.48,3.6 26.87,3.6 27.02,3.45 27.02,3.09 26.87,2.95 26.06,2.95 IC2.5 ; 26.48,3.6 26.48,3.58 26.5,3.56 26.61,3.56 v1(26.89,3.28) ; 26.48,3.6 26.06,3.6 IC2.6 ; IC2.4 23.39,2.89 v1(23.39,2.37) ; 13.23,7.73 12.66,7.15 IC3.2 ; J3.2 32.03,12.42 v1(32.01,12.4) ; 27.96,38.35 28.21,38.6 ; 17.61,41.81 IC1.16 ; v1(20.68,5.83) 21.58,5.83 21.71,5.7 ; v1(34.51,16.2) 34.49,16.18 33.22,16.18 J3.5 ; 11.91,26.6 11.91,26.6 v1(12.51,26.6) ; 23.25,7.91 23.26,7.9 24,7.9 v1(24.01,7.9) 24.01,7.9 24.79,7.9 24.8,7.91 ; 15.81,12.1 15.8,12.11 v1(15.8,12.84) ; v1(7.11,20.3) 7.16,20.36 7.16,20.75 7.41,21 7.51,21 ; 7.36,7.85 v1(7.36,8.55) ; 23.74,13.1 23.77,13.06 23.77,12.24 v1(23.81,12.2) ; 12.61,29.79 IC1.2 ; 10.31,9.6 v1(10.91,9.6) ; v1(30.41,44.4) 30.41,43.34 LED1.1 ; v1(20.31,11.58) 20.31,10.92 20.33,10.89
  Top Layer w0.5: NOREF#46.2 23.41,51.16 23.39,51.18 ; 17.61,41.81 17.61,40.3 v1(17.6,40.3) ; IC1.22 9.1,39.53 7.62,39.53 v1(7.6,39.52) ; v1(19.61,39.5) 19.63,39.52 21.09,39.52 IC1.14 ; IC4.2 10.28,16.98 ; 12.61,28.18 12.61,29.79 ; J2.1 14.62,48.12 NOREF#45.2 ; 27.96,36.69 27.96,38.35 ; v1(29.61,5.8) 29.61,6.5
  vias: v1(10.31,17) v1(12.52,7.15) v1(12.61,28.18) v1(18.5,7.9) v1(18.63,9.88) v1(19.13,11.68) v1(19.7,7.9) v1(20.66,7.88) v1(24.63,9.68) v1(28.01,37.8)
ANT: length 8.5
  Top Layer w0.254: 18.81,44.4 19.02,44.61
  Top Layer w0.9: 18.87,42.5 18.87,44.46
  Top Layer w2.54: 19.02,44.61 19.02,50.81
BAT+: length 58.5
  Top Layer w0.254: 13.23,6.33 11.73,6.33 IC3.1 10.71,6.2 10.52,6.39 10.52,7.92 10.71,8.1 IC3.3
  Top Layer w0.5: 13.23,6.33 14.37,6.33 17.01,8.97 ; 28.32,7.9 28.33,7.91 27.41,8.83 27.41,8.97 ; 28.32,7.9 26.92,6.5 24.8,6.5 24.8,6.51 23.25,6.51 ; 28.32,7.9 31.51,7.9 32.41,7 NOREF#27.9 ; 17.01,8.97 17.01,13.8 15.83,14.98 IC4.7 ; 17.01,8.97 27.41,8.97 ; 23.25,6.51 23.01,6.27 23.01,5 23.11,4.9 IC2.1 23.47,4.9 24.41,4.9 25.06,4.25 26.05,4.25 IC2.7 ; 23.25,6.51 23.25,6.74 23.12,6.87 19.28,6.87 18.01,5.6 ; 25.41,10.6 25.41,10.62 26.08,10.62 26.28,10.42 27.24,10.42 27.52,10.15 27.41,10.04 27.41,8.97
LOAD: length 7.7
  Top Layer w0.254: 28.91,34.19 29.07,34.03
  Top Layer w0.5: 29.07,34.03 32.01,34.03 32.94,34.95 NOREF#4.9
RST: length 41.6
  Top Layer w0.254: v1(23.91,26.3) 24.94,27.33 NOREF#15.2 ; IC1.17 16.35,41.78 v1(16.35,40.18)
  Top Layer w0.5: R2.1 15.86,22.1 J1.5 19.63,22.9 v1(20.51,22.9)
  Bottom Layer w0.254: 17.51,24.4 16.35,25.55 v1(16.35,40.18) ; v1(20.51,22.9) v1(23.91,26.3)
SEN_SCL: length 37.6
  Top Layer w0.254: IC1.5 16.37,28.14 23.21,21.3 24.11,21.3 ; 32.04,13.67 J3.3 ; NOREF#93.3 27.35,21.1 28.5,22.25 NOREF#47.9
  Bottom Layer w0.254: v1(32.01,13.7) 32.01,20.74 33.06,21.96 33.14,22.03 33.23,22.04 NOREF#47.9
SEN_SDA: length 38.7
  Top Layer w0.254: NOREF#17.9 35.55,24.1 35.48,24.02 35.48,24.15 NOREF#17.9 ; NOREF#17.9 24.22,24.79 NOREF#43.3 20.91,24.9 17.62,28.19 IC1.6 ; v1(31.33,14.92) J3.4
  Bottom Layer w0.254: NOREF#17.9 33.7,24.79 31.33,22.41 v1(31.33,14.92)
SOL: length 23.9
  Top Layer w0.254: 11,12.1 11,14.75 13.23,16.98
  Top Layer w0.5: NOREF#75.2 8.31,22.4 9.61,21.1 9.61,19.7 10.51,19.7 13.23,16.98 IC4.9 ; 16.78,17.21 16.56,17.21 16.3,16.96 14.54,16.96
SWCLK: length 7.9
  Top Layer w0.254: IC1.4 15.12,28.01 11.49,24.38 J1.2
SWDIO: length 6.1
  Top Layer w0.254: v1(13.87,28.14) IC1.3
  Bottom Layer w0.254: v1(13.87,28.14) 13.87,26.04 15.51,24.4
$1N6: length 22.1
  Top Layer w0.254: 21.21,35.8 22.65,35.8 26.5,39.65 26.5,41.8 26.78,41.53 27.16,41.53 28.21,40.47 28.21,40.4 28.48,40.67 28.48,41.35 28.73,41.6 31.78,41.6 35.15,44.97 35.98,44.97 NOREF#16.9 36.54,45.11
$1N7: length 3.7
  Top Layer w0.254: 29.81,40.4 29.81,38.6 29.86,38.55 29.86,36.69
$1N11: length 2.8
  Top Layer w0.254: LED2.1 6.86,16.77 6.86,16.67 7.53,16 7.53,15.98 IC4.3
$1N12: length 42.1
  Top Layer w0.254: 35.89,1.9 33.96,1.9 33.16,2.7 33.16,5.16 ; v1(19.41,16.3) 21.91,13.8 21.91,12.3 21.81,12.21 21.81,11.01 21.93,10.89 ; 23.81,10.6 23.71,10.7 v1(23.01,10.7) 22.28,10.7 22.2,10.63 22.02,10.81 ; IC1.7 18.93,29.74 v1(18.93,27.99) ; NOREF#71.9 35.92,1.93 35.89,1.9 36.11,1.68
  Bottom Layer w0.254: v1(33.14,5.17) 33.12,5.19 33.12,7.6 30.02,10.7 23.01,10.7 v1(23.01,10.7) ; v1(19.41,16.3) 19.41,27.25 18.93,27.74 v1(18.93,27.99)
$1N25: length 23.3
  Top Layer w0.254: NOREF#11.2 36.09,50.22 35.93,50.22 35.91,50.21 33.99,50.21 29.78,46 26.71,46 24.21,43.5 24.21,38.6 22.66,37.05 21.12,37.05
$1N26: length 23.8
  Top Layer w0.254: NOREF#21.9 35.24,52.73 29.31,46.8 26.21,46.8 23.21,43.8 23.21,38.9 22.61,38.3 IC1.13
$1N28: length 7.7
  Top Layer w0.254: NOREF#70.2 6.32,32.41 7.21,33.3 IC1.27
$1N29: length 19.6
  Top Layer w0.254: 1.46,52.56 1.99,52.56 ; 1.99,52.56 2.77,52.56 9.23,46.1 12.51,46.1 15.12,43.49 IC1.18 ; 1.99,52.56 NOREF#56.9 ; 1.31,52.7 1.46,52.55
$1N30: length 16.7
  Top Layer w0.254: NOREF#97.9 4.03,50.19 8.92,45.3 12.31,45.3 13.87,43.74 IC1.19
$1N31: length 11.5
  Top Layer w0.254: NOREF#50.9 3.1,45.11 6.28,41.93 6.28,39.5 7.46,38.32 9.1,38.32 IC1.23
$1N32: length 7.4
  Top Layer w0.254: 5.41,34.55 9.12,34.55 ; 5.41,34.55 4.6,34.95 NOREF#60.2
$1N33: length 11.5
  Top Layer w0.254: 1.83,42.29 NOREF#14.9 1.88,42.52 4.27,42.52 5.04,41.75 5.04,39.07 7.09,37.03 9.1,37.03 9.12,37.05
$1N34: length 14.2
  Top Layer w0.254: IC1.20 12.62,43.49 11.61,44.5 8.79,44.5 5.64,47.65 NOREF#94.9
$1N35: length 8
  Top Layer w0.254: IC1.25 5.61,35.8 3.92,37.49 NOREF#22.9
$1N36: length 17
  Top Layer w0.254: v1(26.31,34.5) 25.11,33.3 IC1.9 ; v1(31.22,38.36) 32.91,40.05 32.91,40.2 34.53,41.83
  Bottom Layer w0.254: v1(26.31,34.5) 27.03,34.5 30.5,37.97 30.83,37.97 v1(31.22,38.36)
$1N37: length 21
  Top Layer w0.254: NOREF#82.2 35.94,47.65 35.33,47.04 34.68,47.04 34.02,46.39 33.59,46.39 v1(33.58,46.38) ; 21.12,34.55 22.76,34.55
  Bottom Layer w0.254: v1(33.58,46.38) 33.58,45.32 22.81,34.55 22.76,34.55
  vias: v1(22.76,34.55)
$1N40: length 18.3
  Top Layer w0.254: v1(31.21,37.29) 32.59,37.29 35.17,39.87 35.96,39.87 NOREF#55.2 ; v1(26.81,33.5) 25.36,32.05 IC1.8
  Bottom Layer w0.254: v1(31.21,37.29) 31.15,37.23 30.53,37.23 v1(26.81,33.5)
$1N50: length 2
  Top Layer w0.254: 26.5,43.4 26.51,43.4 26.59,43.32 LED1.2
$1N57: length 5.6
  Top Layer w0.4: IC2.3 23.43,3.58 22.71,3.58 22.46,3.34 18.07,3.34 18.01,3.4
$1N60: length 1.3
  Top Layer w0.254: 8.91,9.6 8.91,10.8 9.01,10.9
$1N61: length 1.5
  Top Layer w0.254: 9.01,12.5 9.01,13.88 IC4.5
$1N63: length 16.6
  Top Layer w0.254: v1(16.01,16) 15.98,15.98 IC4.8
  Top Layer w0.5: 27.82,15.85 27.81,15.85 27.41,15.45 v1(27.41,14.4) 27.41,13.16 27.52,13.05
  Bottom Layer w0.254: v1(16.01,16) 17.01,16 18.61,14.4 v1(27.41,14.4)
$1N64: length 5.9
  Top Layer w0.254: 23.82,18.16 23.74,18.08 23.74,16.3
  Top Layer w0.5: 27.82,18.05 27.76,18.11 23.88,18.11 23.82,18.16
$1N72: length 1.6
  Top Layer w0.5: 18.98,18.16 20.62,18.16
$1N73: length 3.2
  Top Layer w0.254: IC4.10 14.61,17.98 14.81,18.17 14.81,18.9 14.96,19.05 16.72,19.05 16.78,19.11
$1N75: length 7.8
  Top Layer w0.254: 5.51,24.4 5.56,24.34 v1(5.56,23.28) ; LED2.2 4.96,17.06 4.96,20.9 v1(5.49,21.44)
  Bottom Layer w0.254: v1(5.56,23.28) 5.53,23.25 5.53,21.47 v1(5.49,21.44)
$1N76: length 3.7
  Top Layer w0.254: IC4.6 14.41,13.98 14.21,13.78 14.21,12.1 12.6,12.1
$1N77: length 10.8
  Top Layer w0.254: NOREF#51.12 1.6,27.33 1.63,27.3 2.08,27.3 2.11,27.33 4.41,27.33 6.51,29.43 6.51,31.3 7.26,32.05 IC1.28
$1N78: length 2.4
  Top Layer w0.254: 8.21,19.7 8.24,19.66 8.24,18.36 8.43,18.17 8.9,18.17 IC4.1
$1N83: length 8.5
  Top Layer w0.254: 1.31,15.1 1.92,15.24 2.05,15.24 2.18,15.12 2.18,15.1 2.31,14.98 ; IC4.4 7.25,14.98 6.91,14.63 NOREF#118.12

## Copper pours and planes (outline as drawn; the poured copper is in the pictures)
GND on Top Layer: 23.41,38.9 23.41,53.8 34.51,53.8 34.61,53.7 34.61,0.2 3.51,0.2 3.51,38.9 0.71,38.9 0.31,39.3 0.41,39.4 0.41,40.9 3.91,40.9 4.31,41.3 4.31,53.6 14.51,53.6 14.51,38.9
GND on Top Layer: 17.91,8.4 25.51,8.4 25.51,7.3 25.41,7.2 17.91,7.2
GND on Bottom Layer: -0.19,53.8 37.91,53.8 37.91,0 -0.19,0
BAT+ on Top Layer: 16.4,9.72 17.76,9.72 17.76,8.36 16.4,8.36
BAT+ on Top Layer: 16.4,9.72 17.76,9.72 17.76,8.36 16.4,8.36
SOL on Top Layer: 12.61,17.58 13.84,17.58 13.84,16.71 12.61,16.71

Small or netless copper shapes (teardrops, artwork), in the pictures only: 131 on Top Layer, 3 on Bottom Layer

## Text on the board
Top Silkscreen Layer: GND | pull-up opt. | pollutag | rev.4 | by pollutants.eu | Node2 | SWD
